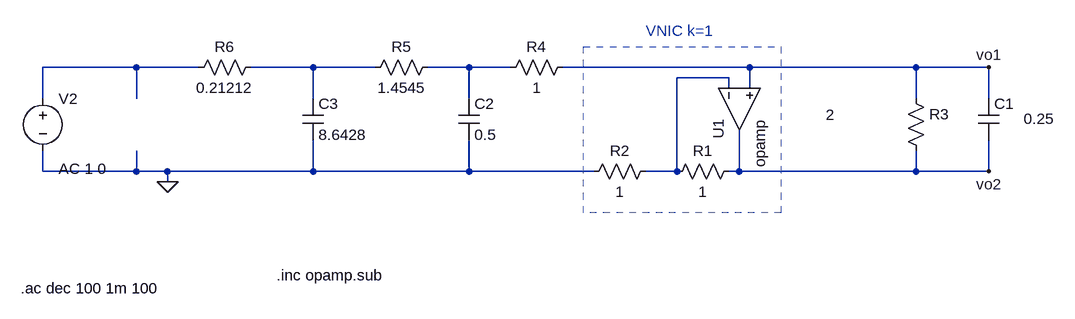
[diagram p0: schematic circuito_Rev2.asc]
circuito_Rev2.asc, the LTspice schematic file:
Version 4
SHEET 1 880 680
WIRE -720 64 -864 64
WIRE -624 64 -720 64
WIRE -448 64 -544 64
WIRE -352 64 -448 64
WIRE -208 64 -272 64
WIRE -144 64 -208 64
WIRE 224 64 -64 64
WIRE 480 64 224 64
WIRE 592 64 480 64
WIRE 192 80 112 80
WIRE 192 96 192 80
WIRE 224 96 224 64
WIRE -864 112 -864 64
WIRE -720 112 -720 64
WIRE -448 112 -448 64
WIRE -208 112 -208 64
WIRE 480 112 480 64
WIRE 592 112 592 64
WIRE -864 224 -864 192
WIRE -720 224 -720 192
WIRE -720 224 -864 224
WIRE -672 224 -720 224
WIRE -448 224 -448 176
WIRE -448 224 -672 224
WIRE -208 224 -208 176
WIRE -208 224 -448 224
WIRE -16 224 -208 224
WIRE 112 224 112 80
WIRE 112 224 64 224
WIRE 208 224 208 160
WIRE 208 224 192 224
WIRE 480 224 480 192
WIRE 480 224 208 224
WIRE 592 224 592 176
WIRE 592 224 480 224
WIRE -672 240 -672 224
FLAG -672 240 0
FLAG 592 64 vo1
FLAG 592 224 vo2
SYMBOL OpAmps\\opamp 144 128 M90
SYMATTR InstName U1
SYMATTR SpiceLine Aol=100000K
SYMATTR SpiceLine2 GBW=1000000Meg
SYMBOL res 208 208 R90
WINDOW 0 0 56 VBottom 2
WINDOW 3 32 56 VTop 2
SYMATTR InstName R1
SYMATTR Value 1
SYMBOL res 80 208 R90
WINDOW 0 0 56 VBottom 2
WINDOW 3 32 56 VTop 2
SYMATTR InstName R2
SYMATTR Value 1
SYMBOL res 464 96 R0
WINDOW 3 -123 41 Left 2
SYMATTR Value 2
SYMATTR InstName R3
SYMBOL cap 576 112 R0
WINDOW 3 70 31 Left 2
SYMATTR Value 0.25
SYMATTR InstName C1
SYMBOL res -48 48 R90
WINDOW 0 0 56 VBottom 2
WINDOW 3 32 56 VTop 2
SYMATTR InstName R4
SYMATTR Value 1
SYMBOL cap -224 112 R0
SYMATTR InstName C2
SYMATTR Value 0.5
SYMBOL res -256 48 R90
WINDOW 0 0 56 VBottom 2
WINDOW 3 32 56 VTop 2
SYMATTR InstName R5
SYMATTR Value 1.4545
SYMBOL cap -464 112 R0
SYMATTR InstName C3
SYMATTR Value 8.6428
SYMBOL res -640 80 R270
WINDOW 0 32 56 VTop 2
WINDOW 3 0 56 VBottom 2
SYMATTR InstName R6
SYMATTR Value 0.21212
SYMBOL voltage -864 96 R0
WINDOW 123 24 124 Left 2
WINDOW 39 0 0 Left 0
SYMATTR InstName V2
SYMATTR Value ""
SYMATTR Value2 AC 1 0
TEXT -504 384 Left 2 !.inc opamp.sub
TEXT 64 8 Left 2 ;VNIC k=1
TEXT -898 404 Left 2 !.ac dec 100 1m 100
RECTANGLE Normal 272 288 -32 32 2

The netlist it stands for:
* circuito_Rev2.asc
XU1 N004 vo1 vo2 opamp Aol=100000K GBW=1000000Meg  ; pins invin noninvin out
R1 vo2 N004 1
R2 N004 0 1
R3 vo1 vo2 2
C1 vo1 vo2 0.25
R4 vo1 N003 1
C2 N003 0 0.5
R5 N003 N002 1.4545
C3 N002 0 8.6428
R6 N001 N002 0.21212
V2 N001 0 AC 1 0
.inc opamp.sub
* VNIC k=1
.ac dec 100 1m 100
.backanno
.end

* Results of the author's LTspice run, read from the files saved beside the schematic
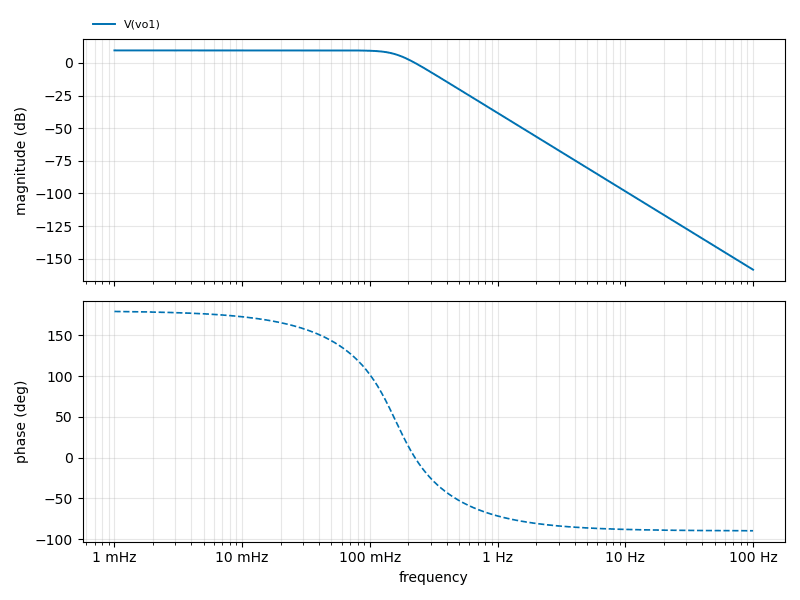
[diagram p1: AC Analysis of circuito_Rev2.asc, plotted from the saved traces]
* AC Analysis, 1 run:
*   V(vo1): 9.54 dB at 1 mHz, -158.35 dB at 100 Hz, peak 9.54 dB at 14.79 mHz, 3 dB below the peak at 159.1 mHz